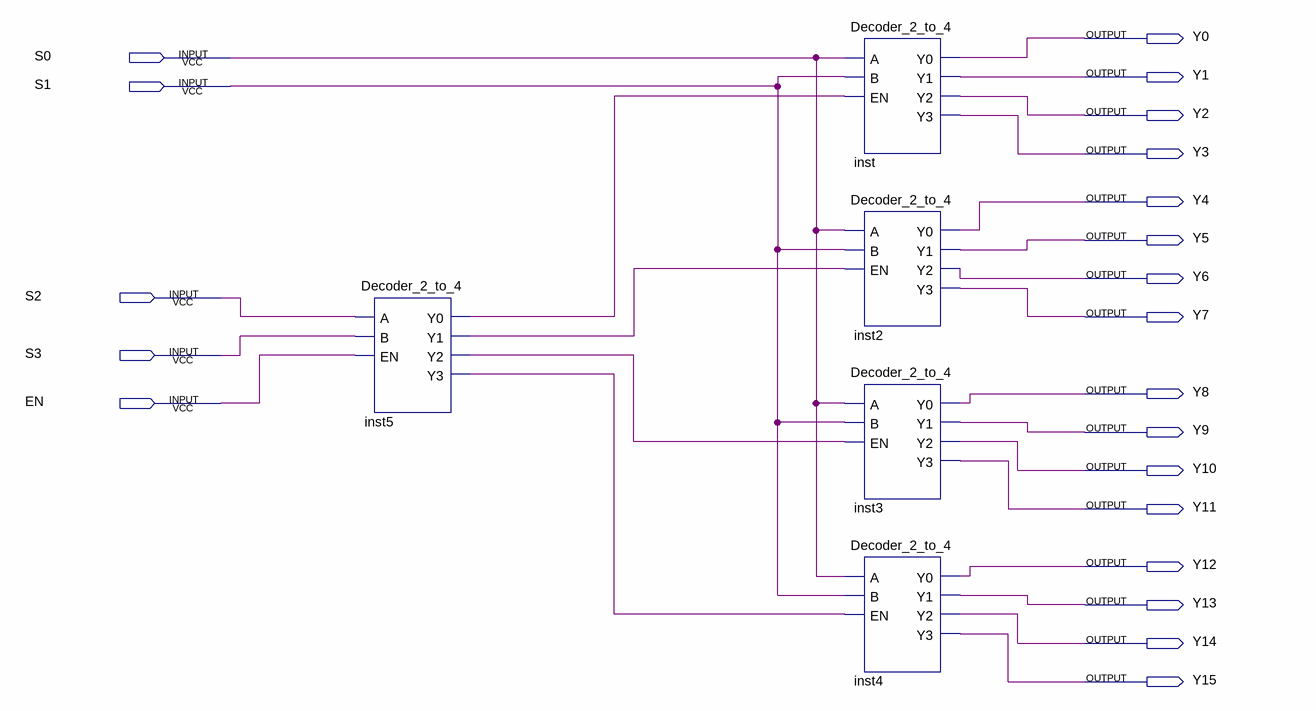
[diagram p0: schematic sheet]
// Quartus schematic Decoder_4_to_16.bdf as structural Verilog: 5 symbols, 21 pins
module Decoder_4_to_16 (
  input  S0,
  input  S1,
  input  S2,
  input  S3,
  input  EN,
  output Y0,
  output Y1,
  output Y2,
  output Y3,
  output Y4,
  output Y5,
  output Y6,
  output Y7,
  output Y8,
  output Y9,
  output Y10,
  output Y11,
  output Y12,
  output Y13,
  output Y14,
  output Y15
);

  wire inst5_y0, inst5_y1, inst5_y2, inst5_y3;

  Decoder_2_to_4 inst5 (.A(S2), .B(S3), .EN(EN), .Y0(inst5_y0), .Y1(inst5_y1), .Y2(inst5_y2), .Y3(inst5_y3));
  Decoder_2_to_4 inst (.A(S0), .B(S1), .EN(inst5_y0), .Y0(Y0), .Y1(Y1), .Y2(Y2), .Y3(Y3));
  Decoder_2_to_4 inst2 (.A(S0), .B(S1), .EN(inst5_y1), .Y0(Y4), .Y1(Y5), .Y2(Y6), .Y3(Y7));
  Decoder_2_to_4 inst3 (.A(S0), .B(S1), .EN(inst5_y2), .Y0(Y8), .Y1(Y9), .Y2(Y10), .Y3(Y11));
  Decoder_2_to_4 inst4 (.A(S0), .B(S1), .EN(inst5_y3), .Y0(Y12), .Y1(Y13), .Y2(Y14), .Y3(Y15));
endmodule
